# EAGLE design Main (EAGLE 7.2.0)
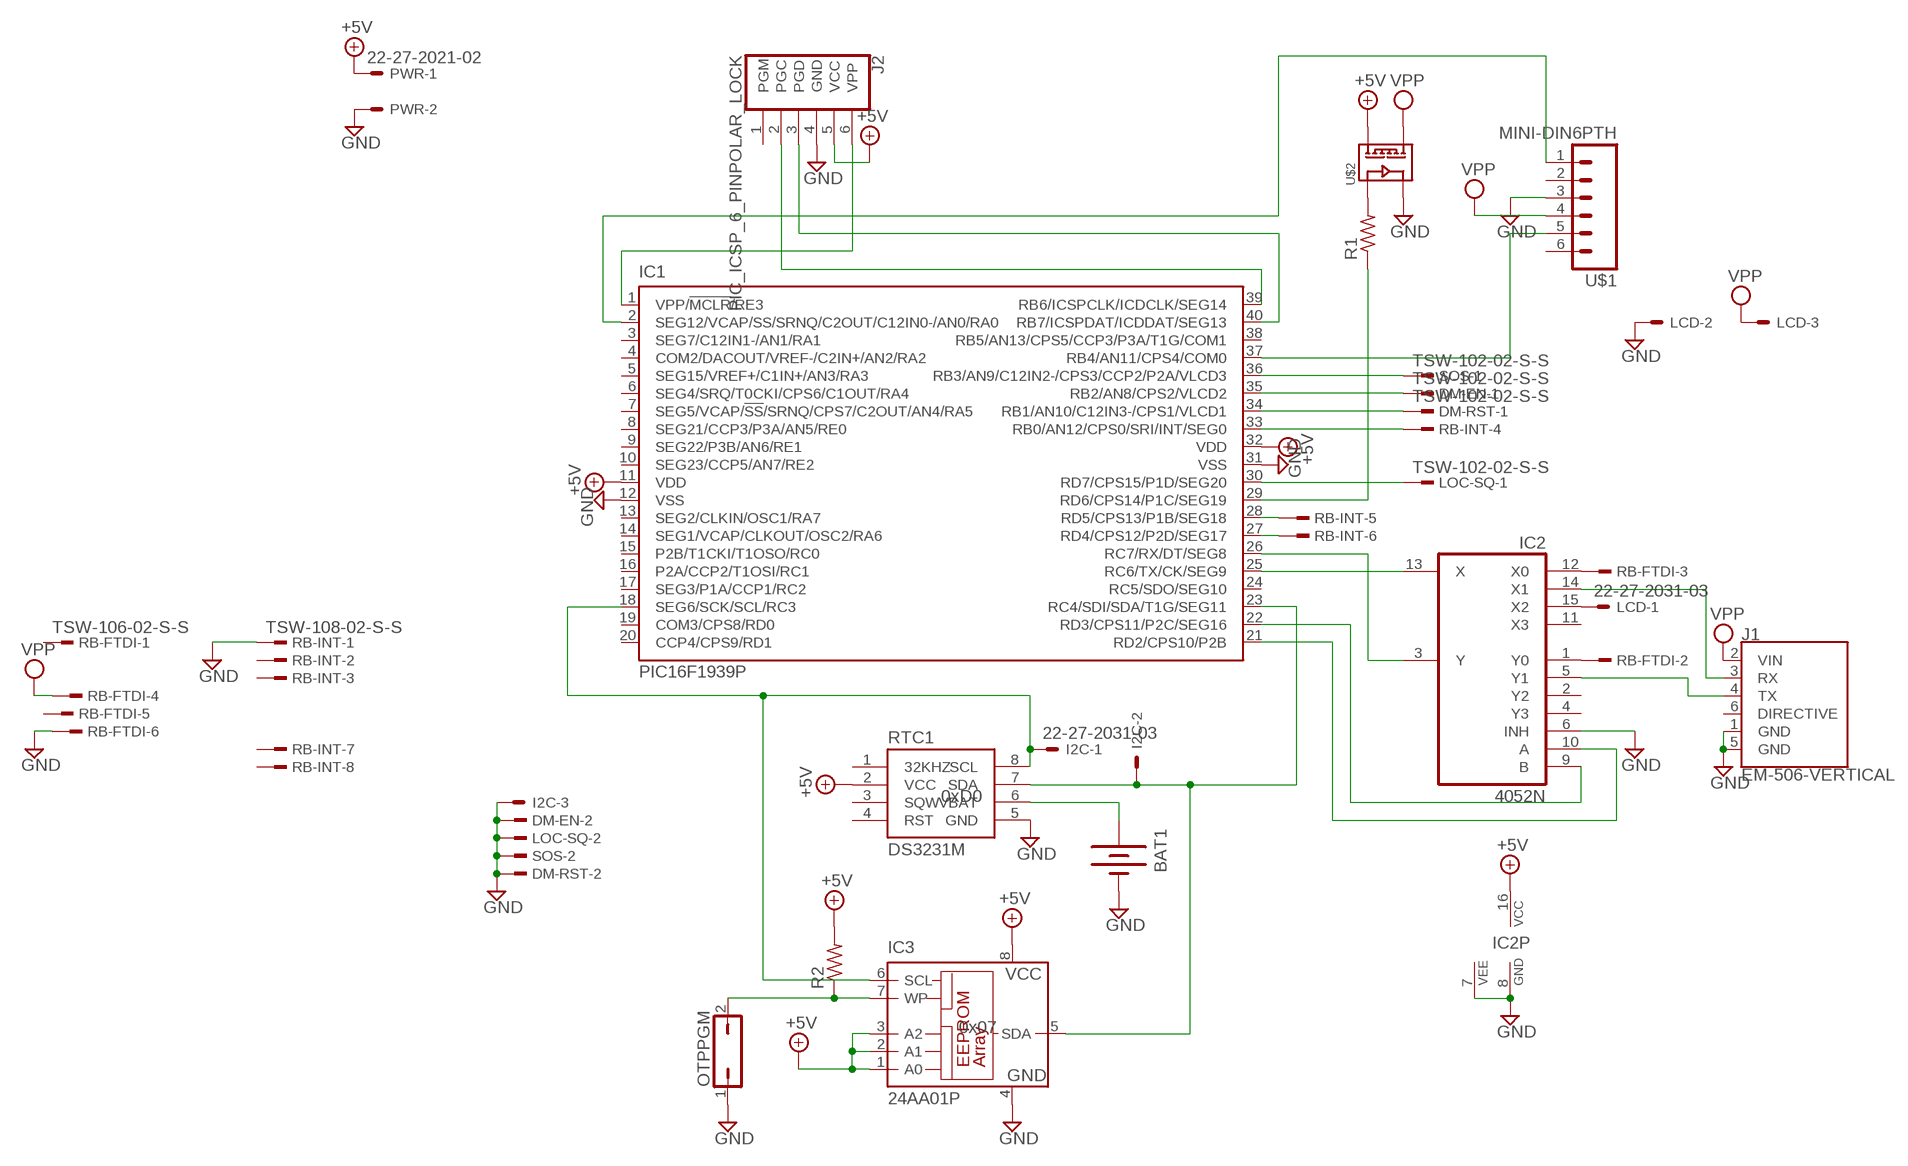
[diagram p0: schematic, sheet 1]

## Parts
BAT1  BATTERY12PTH  [BATTCON_12MM_PTH]
DM-EN  TSW-102-02-S-S  [TSW-102-02-S-S]
DM-RST  TSW-102-02-S-S  [TSW-102-02-S-S]
I2C  22-27-2031-03  [6410-03]
IC1  PIC16F1939P  [DIL40]
IC2  4052N  [DIL16]
IC3  24AA01P  [DIL8]
J1  EM-506-VERTICAL  [EM406]
J2  PIC_ICSP_6_PINPOLAR_LOCK  [MOLEX-1X6_LOCK]
LCD  22-27-2031-03  [6410-03]
LOC-SQ  TSW-102-02-S-S  [TSW-102-02-S-S]
OTPPGM  JP1Q  [JP1]
PWR  22-27-2021-02  [6410-02]
R1  R-US_0204/2V  [0204V]
R2  R-US_0204/2V  [0204V]
RB-FTDI  TSW-106-02-S-S  [TSW-106-02-S-S]
RB-INT  TSW-108-02-S-S  [TSW-108-02-S-S]
RTC1  DS3231M  [SOIC8]
SOS  TSW-102-02-S-S  [TSW-102-02-S-S]
U$1  MINI-DIN6PTH  [MINI-DIN6]
U$2  CPC1008N  [SOP04]

## Nets
+5V: IC1.11(VDD) IC1.32(VDD) IC2.16(VCC) IC3.1(A0) IC3.2(A1) IC3.3(A2) IC3.8(VCC) J2.5(VCC) PWR.1 R2.2 RTC1.2(VCC) U$2.4(DC)
GND: BAT1.GND(-) DM-EN.2 DM-RST.2 I2C.3 IC1.12(VSS) IC1.31(VSS) IC2.6(INH) IC2.7(VEE) IC2.8(GND) IC3.4(GND) J1.1(GND) J1.5(GND) J2.4(GND) LCD.2 LOC-SQ.2 OTPPGM.1 PWR.2 RB-FTDI.6 RB-INT.1 RTC1.5(GND) SOS.2 U$1.3 U$2.3(IN-)
N$1: IC1.26(RC7/RX/DT/SEG8) IC2.3(Y)
N$2: IC1.25(RC6/TX/CK/SEG9) IC2.13(X)
N$3: I2C.1 IC1.18(SEG6/SCK/SCL/RC3) IC3.6(SCL) RTC1.8(SCL)
N$4: I2C.2 IC1.23(RC4/SDI/SDA/T1G/SEG11) IC3.5(SDA) RTC1.7(SDA)
N$5: IC1.30(RD7/CPS15/P1D/SEG20) LOC-SQ.1
N$6: BAT1.VCC@1(+) RTC1.6(VBAT)
N$7: IC2.12(X0) RB-FTDI.3
N$8: IC2.1(Y0) RB-FTDI.2
N$9: IC2.14(X1) J1.3(RX)
N$10: IC2.5(Y1) J1.4(TX)
N$11: IC1.22(RD3/CPS11/P2C/SEG16) IC2.9(B)
N$12: IC2.15(X2) LCD.1
N$13: IC1.21(RD2/CPS10/P2B) IC2.10(A)
N$14: IC1.37(RB4/AN11/CPS4/COM0) U$1.5
N$15: IC1.39(RB6/ICSPCLK/ICDCLK/SEG14) J2.2(PGC)
N$16: IC1.40(RB7/ICSPDAT/ICDDAT/SEG13) J2.3(PGD)
N$17: R1.2 U$2.1(IN+)
N$18: IC1.33(RB0/AN12/CPS0/SRI/INT/SEG0) RB-INT.4
N$19: IC1.28(RD5/CPS13/P1B/SEG18) RB-INT.5
N$20: IC1.27(RD4/CPS12/P2D/SEG17) RB-INT.6
N$21: DM-RST.1 IC1.34(RB1/AN10/C12IN3-/CPS1/VLCD1)
N$22: DM-EN.1 IC1.35(RB2/AN8/CPS2/VLCD2)
N$23: IC1.36(RB3/AN9/C12IN2-/CPS3/CCP2/P2A/VLCD3) SOS.1
N$24: IC1.2(SEG12/VCAP/SS/SRNQ/C2OUT/C12IN0-/AN0/RA0) U$1.1
N$26: IC1.29(RD6/CPS14/P1C/SEG19) R1.1
N$27: IC3.7(WP) OTPPGM.2 R2.1
N$28: IC1.1(VPP/!MCLR!/RE3) J2.6(VPP)
VPP: J1.2(VIN) LCD.3 RB-FTDI.4 U$1.4 U$2.6(DC)
Unconnected: IC1.3(SEG7/C12IN1-/AN1/RA1) IC1.4(COM2/DACOUT/VREF-/C2IN+/AN2/RA2) IC1.5(SEG15/VREF+/C1IN+/AN3/RA3) IC1.6(SEG4/SRQ/T0CKI/CPS6/C1OUT/RA4) IC1.7(SEG5/VCAP/!SS!/SRNQ/CPS7/C2OUT/AN4/RA5) IC1.8(SEG21/CCP3/P3A/AN5/RE0) IC1.9(SEG22/P3B/AN6/RE1) IC1.10(SEG23/CCP5/AN7/RE2) IC1.13(SEG2/CLKIN/OSC1/RA7) IC1.14(SEG1/VCAP/CLKOUT/OSC2/RA6) IC1.15(P2B/T1CKI/T1OSO/RC0) IC1.16(P2A/CCP2/T1OSI/RC1) IC1.17(SEG3/P1A/CCP1/RC2) IC1.19(COM3/CPS8/RD0) IC1.20(CCP4/CPS9/RD1) IC1.24(RC5/SDO/SEG10) IC1.38(RB5/AN13/CPS5/CCP3/P3A/T1G/COM1) IC2.2(Y2) IC2.4(Y3) IC2.11(X3) J1.6(DIRECTIVE) J2.1(PGM) RB-FTDI.1 RB-FTDI.5 RB-INT.2 RB-INT.3 RB-INT.7 RB-INT.8 RTC1.1(32KHZ) RTC1.3(SQW) RTC1.4(RST) U$1.2 U$1.6

## Library data of the parts
BAT1 = SparkFun-Electromechanical:BATTERY: Battery Holders Various common sizes : AA, AAA, 18650 (PRT-12895), 20mm coin cell and 12mm coin cell. 20MM_4LEGS, BATT-10373; PROD_ID: BATT-08315
DM-EN DM-RST LOC-SQ SOS = con-samtec:TSW-102-02-S-S: THROUGH-HOLE .025" SQ POST HEADER Source: Samtec TSW.pdf; OC_FARNELL: unknown; OC_NEWARK: unknown
I2C LCD = con-molex:22-?-03: CONNECTOR wire to board 2.54 mm (.1 inch) pitch header; OC_FARNELL: unknown; OC_NEWARK: unknown
IC1 = microchip:PIC16F193*?: Flash-Based, 8-Bit CMOS Microcontrollers wtih LCD Driver and nanoWatt XLP Technology Auto generated by make-symbol-device-package-bsdl.ulp Rev. 33 Source: http://ww1.microchip.com/downloads/en/DeviceDoc/41364D.pdf; MPN: PIC16F1939-I/P; OC_FARNELL: 1755832; OC_NEWARK: 08R1958
IC2 = 40xx:4052: Dual 4-channel ANALOG MULTIPLEXER
IC3 = microchip:24*: Serial EEPROM I2C; I2CADDR: 0x07; MPN: 24AA01-I/P; OC_FARNELL: 1331266; OC_NEWARK: 35M0692
J1 = SparkFun-RF:EM-506: EM-506 High Performance GPS Module EM-506 GPS module features high sensitivity, low power and ultra small form factor. This GPS module is powered by SiRF Star IV, it can provide you with superior sensitivity and performance even in urban canyon and dense foliage environment. With SiRF CGEE (Client Generated Extended Ephemeris) technology, it predicts satellite positions for up to 3 days and delivers CGEE-start time of less than 15 seconds under most conditions, without any network assistance. Besides, MicroPower Mode allows GPS module to stay in a hot-start condition nearly continuously while consuming very little power. Product Features: SiRF Star IV high performance GPS Chipset Very high sensitivity (Tracking Sensitivity: -163 dBm) Extremely fast TTFF (Time To First Fix) at low signal level Support UART interface. Built-in LNA(with in CHIP) Compact size (30.0mm x 30.0 mm x 10.7mm) suitable for space-sensitive application Support NMEA 0183 V3.0 (GGA, GSA, GSV, RMC, VTG, GLL, ZDA) Support OSP protocol Support SBAS (WASS, EGNOS, MSAS, GAGAN); PROD_ID: CONN-08249
J2 = SparkFun-Connectors:PIC_ICSP_6_PIN: ISCP Programming connector for PICs This 6 pin header contains all the lines necessary for programming most PIC microcontrollers. Here is the connector we sell at SparkFun: Polarized Connectors - Header (6-Pin) <https://www.sparkfun.com/products/8094> (PRT-08094) It is used on this SparkFun product: SparkFun UDB5 - PIC UAV Development Board <https://www.sparkfun.com/products/11703> (DEV-11703) Also, if you need a nice PIC programmer, please check these out: MPLAB PICkit 3 <https://www.sparkfun.com/products/9973> (PGM-09973)
OTPPGM = jumper:JP1Q: JUMPER
PWR = con-molex:22-?-02: CONNECTOR wire to board 2.54 mm (.1 inch) pitch header; OC_FARNELL: unknown; OC_NEWARK: unknown
R1 R2 = resistor:R-US_: RESISTOR, American symbol
RB-FTDI = con-samtec:TSW-106-02-S-S: THROUGH-HOLE .025" SQ POST HEADER Source: Samtec TSW.pdf; OC_FARNELL: unknown; OC_NEWARK: unknown
RB-INT = con-samtec:TSW-108-02-S-S: THROUGH-HOLE .025" SQ POST HEADER Source: Samtec TSW.pdf; OC_FARNELL: unknown; OC_NEWARK: unknown
RTC1 = SparkFun-DigitalIC:DS3231M: DS3231M Real Time Clock. Accuracy +/-5ppm. Battery Backup. 2.3V to 5.5V.; I2CADDR: 0xD0; PROD_ID: IC-11985
U$1 = SparkFun-Connectors:MINI-DIN6: mini DIN 6 Connector Commonly found on the back of a computer for PS2 keyboard and mice. Schematic and footprint are proven. Spark Fun Electronics SKU : PRT-08509
U$2 = JSB2:CPC1008N

## Board
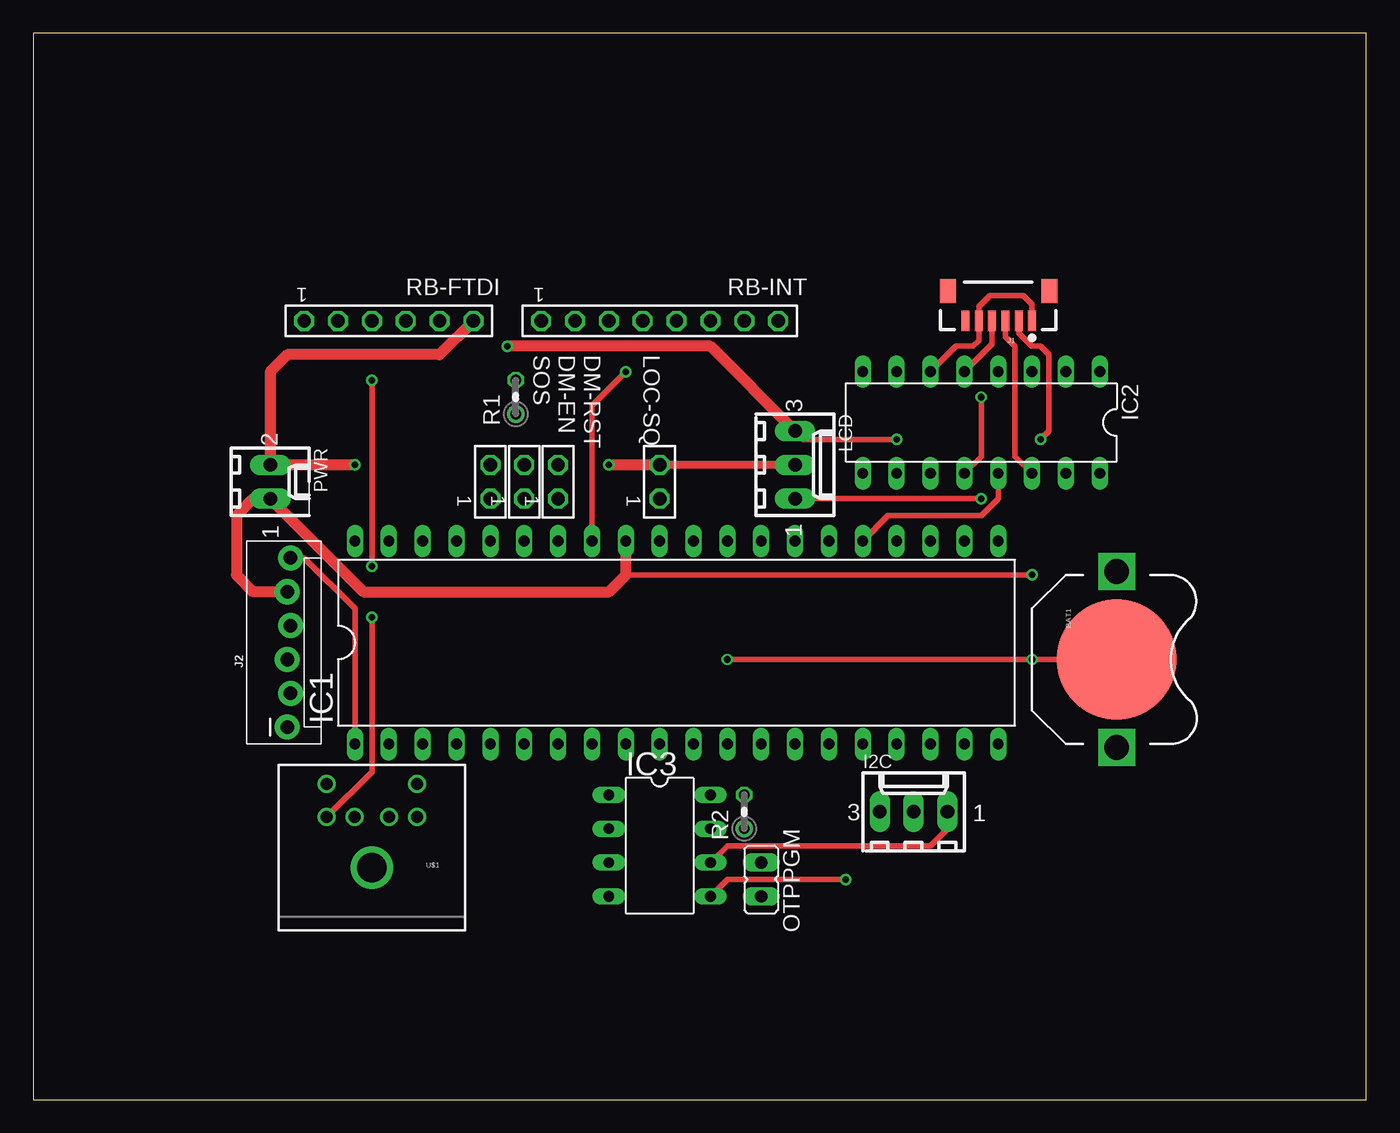
[diagram p1: board, top side]
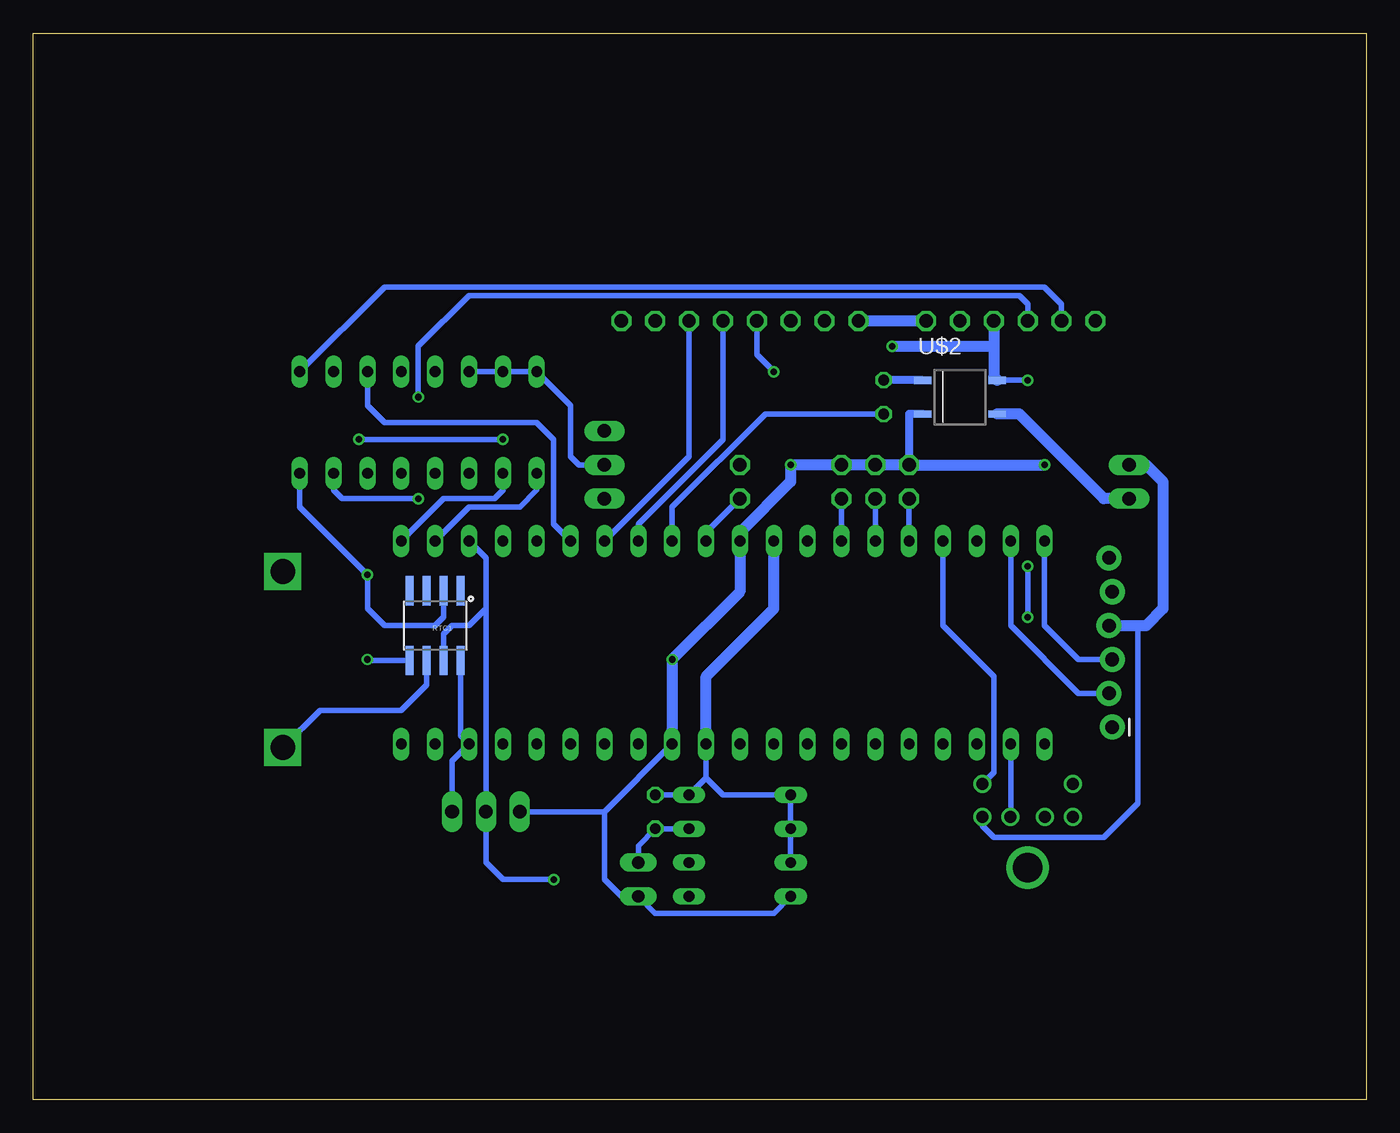
[diagram p2: board, bottom side, seen from below]

Size 100 x 80 mm. Coordinates in mm from the lower left corner, seen from the top.
Outline: 0,0 100,0 100,80 0,80 0,0
Copper layers (1*16): Top 0.0356mm / dielectric 1.5011mm / Bottom 0.0356mm
Design rules "Oshpark": minimum track width 6mil, minimum drill 13mil, track to track 6mil, track to pad 6mil, pad to pad 6mil, via to via 6mil, smd to smd 6mil, copper to edge 15mil, drill to drill 6mil, minimum pad ring 7mil, minimum via ring 7mil, stop-mask expansion 3mil, vias tented up to drill 0mil, thermal gap 10mil

### Footprints (pad centres in the part's own frame; a part is rotated, then mirrored left to right if it is on the bottom)
BATTCON_12MM_PTH = smd 9 x 9: GND 0,0 | drill 1.854 square: VCC@1 6.604,0; VCC@2 -6.604,0
TSW-102-02-S-S = drill 1 pad 1.5 octagon: 1 1.27,0; 2 -1.27,0
6410-03 = drill 1.016 long: 1 2.54,0; 2 0,0; 3 -2.54,0
DIL40 = drill 0.813 long: 1 -24.13,-7.62; 2 -21.59,-7.62; 3 -19.05,-7.62; 4 -16.51,-7.62; 5 -13.97,-7.62; 6 -11.43,-7.62; 7 -8.89,-7.62; 8 -6.35,-7.62; 9 -3.81,-7.62; 10 -1.27,-7.62; 11 1.27,-7.62; 12 3.81,-7.62; 13 6.35,-7.62; 14 8.89,-7.62; 15 11.43,-7.62; 16 13.97,-7.62; 17 16.51,-7.62; 18 19.05,-7.62; 19 21.59,-7.62; 20 24.13,-7.62; 21 24.13,7.62; 22 21.59,7.62; 23 19.05,7.62; 24 16.51,7.62; 25 13.97,7.62; 26 11.43,7.62; 27 8.89,7.62; 28 6.35,7.62; 29 3.81,7.62; 30 1.27,7.62; 31 -1.27,7.62; 32 -3.81,7.62; 33 -6.35,7.62; 34 -8.89,7.62; 35 -11.43,7.62; 36 -13.97,7.62; 37 -16.51,7.62; 38 -19.05,7.62; 39 -21.59,7.62; 40 -24.13,7.62
DIL16 = drill 0.813 long: 1 -8.89,-3.81; 2 -6.35,-3.81; 3 -3.81,-3.81; 4 -1.27,-3.81; 5 1.27,-3.81; 6 3.81,-3.81; 7 6.35,-3.81; 8 8.89,-3.81; 9 8.89,3.81; 10 6.35,3.81; 11 3.81,3.81; 12 1.27,3.81; 13 -1.27,3.81; 14 -3.81,3.81; 15 -6.35,3.81; 16 -8.89,3.81
DIL8 = drill 0.813 long: 1 -3.81,-3.81; 2 -1.27,-3.81; 3 1.27,-3.81; 4 3.81,-3.81; 5 3.81,3.81; 6 1.27,3.81; 7 -1.27,3.81; 8 -3.81,3.81
EM406 = smd 0.6 x 1.55: 1 0,0; 2 1,0; 3 2,0; 4 3,0; 5 4,0; 6 5,0 | smd 1.2 x 1.8: P$1 -1.3,-2.225; P$2 6.3,-2.225
MOLEX-1X6_LOCK = drill 1.016 pad 1.88: 1 0,0; 2 2.54,-0.254; 3 5.08,0; 4 7.62,-0.254; 5 10.16,0; 6 12.7,-0.254
JP1 = drill 0.914 long: 1 0,-1.27; 2 0,1.27
6410-02 = drill 1.016 long: 1 1.27,0; 2 -1.27,0
0204V = drill 0.813 octagon: 1 -1.27,0; 2 1.27,0
TSW-106-02-S-S = drill 1 pad 1.5 octagon: 1 6.35,0; 2 3.81,0; 3 1.27,0; 4 -1.27,0; 5 -3.81,0; 6 -6.35,0
TSW-108-02-S-S = drill 1 pad 1.5 octagon: 1 8.89,0; 2 6.35,0; 3 3.81,0; 4 1.27,0; 5 -1.27,0; 6 -3.81,0; 7 -6.35,0; 8 -8.89,0
SOIC8 = smd 0.61 x 2.21: 1 -1.905,-2.616; 2 -0.635,-2.616; 3 0.635,-2.616; 4 1.905,-2.616; 5 1.905,2.616; 6 0.635,2.616; 7 -0.635,2.616; 8 -1.905,2.616
MINI-DIN6 = drill 0.9: 1 -1.3,-8.5; 2 1.3,-8.5; 3 -3.4,-8.5; 4 3.4,-8.5; 5 -3.4,-11; 6 3.4,-11 | drill 2.2: P$1 0,-4.7
SOP04 = smd 0.551 x 1.3: 1 -1.27,-2.8; 3 1.27,-2.8; 4 1.27,2.8; 6 -1.27,2.8

### Placement (x,y rotation side)
BAT1  81.28,33.02 270 top
DM-EN  36.83,46.35 270 top
DM-RST  39.37,46.35 270 top
I2C  66.04,21.59 0 top
IC1  48.26,34.29 0 top
IC2  71.12,50.8 180 top
IC3  46.99,19.05 270 top
J1  74.93,58.42 180 top
J2  19.05,27.94 90 top
LCD  57.15,47.62 270 top
LOC-SQ  46.99,46.35 270 top
OTPPGM  54.61,16.51 0 top
PWR  17.78,46.35 270 top
R1  36.2,52.7 90 top
R2  53.34,21.59 90 top
RB-FTDI  26.67,58.42 180 top
RB-INT  46.99,58.42 180 top
RTC1  69.85,35.56 180 bottom
SOS  34.29,46.35 270 top
U$1  25.4,12.7 180 top
U$2  30.48,52.7 270 bottom

### Tracks (layer width: path | path; a pad name or v marks a point on that pad's centre or on a via)
+5V  (via drill 0.5)
  Top 0.406: 44.45,39.37 v74.93,39.37
  Top 0.813: IC1.32 44.45,39.37 43.18,38.1 24.77,38.1 PWR.1 16.51,45.09 15.24,43.81 15.24,39.37 16.51,38.1 J2.5
  Bottom 0.406: RTC1.2 69.22,36.2 69.85,35.56 73.66,35.56 74.93,36.83 v74.93,39.37 80.01,44.45 IC2.16 | IC3.3 IC3.2 IC3.1 48.26,22.86 49.53,24.13 | IC1.11 49.53,24.13 | 49.53,24.13 IC3.8 R2.2
  Bottom 0.813: PWR.1 19.68,45.09 26.04,51.44 U$2.4 | IC1.11 49.53,31.75 44.45,36.83 IC1.32
GND  (via drill 0.5)
  Top 0.406: BAT1.GND v74.93,33.02 v52.07,33.02 | IC2.6 69.22,56.52 70.48,56.52 70.93,56.96 J1.5 70.93,59.5 71.75,60.33 74.3,60.33 74.93,59.69 J1.1
  Top 0.61: LCD.2 LOC-SQ.2
  Top 0.813: v24.13,47.62 PWR.2 17.78,54.61 19.05,55.88 30.48,55.88 RB-FTDI.6 | LOC-SQ.2 v43.18,47.62
  Bottom 0.406: RTC1.5 74.85,32.94 v74.93,33.02 | IC2.6 IC2.7 IC2.8 59.69,52.07 59.69,48.26 59.05,47.62 LCD.2 | U$1.3 28.8,20.55 27.94,19.68 19.68,19.68 17.14,22.23 17.14,35.56 | IC1.12 57.15,21.59 | 57.15,21.59 I2C.3 | 57.15,21.59 57.15,16.51 55.88,15.24 OTPPGM.1 53.34,13.97 44.45,13.97 IC3.4
  Bottom 0.61: U$2.3 34.29,51.44 SOS.2
  Bottom 0.813: PWR.2 16.51,47.62 15.24,46.35 15.24,36.83 16.51,35.56 17.14,35.56 J2.4 | IC1.12 v52.07,33.02 46.99,38.1 IC1.31 46.99,42.55 43.18,46.35 v43.18,47.62 DM-RST.2 DM-EN.2 SOS.2 v24.13,47.62 | RB-FTDI.6 RB-INT.1
N$1
  Bottom 0.406: IC1.26 60.96,43.18 60.96,49.53 62.23,50.8 73.66,50.8 74.93,52.07 IC2.3
N$2
  Top 0.406: IC1.25 64.14,43.81 71.12,43.81 72.39,45.09 IC2.13
N$3
  Top 0.406: IC3.6 52.07,19.05 67.31,19.05 68.58,20.32 I2C.1
  Bottom 0.406: RTC1.8 67.94,27.3 IC1.18 68.58,25.4 I2C.1
N$4  (via drill 0.5)
  Top 0.406: IC3.5 52.07,16.51 v60.96,16.51
  Bottom 0.406: RTC1.7 69.22,34.92 68.58,35.56 67.31,35.56 66.04,36.83 | 66.04,36.83 66.04,40.64 IC1.23 | 66.04,36.83 I2C.2 66.04,17.78 64.77,16.51 v60.96,16.51
N$5
  Bottom 0.406: IC1.30 49.53,42.55 LOC-SQ.1
N$6
  Bottom 0.406: RTC1.6 70.48,31.11 72.39,29.21 78.49,29.21 BAT1.VCC@1
N$7  (via drill 0.5)
  Top 0.406: v71.12,52.7 71.12,48.26 IC2.12
  Bottom 0.406: RB-FTDI.3 25.4,59.69 26.04,60.33 67.31,60.33 71.12,56.52 v71.12,52.7
N$8
  Bottom 0.406: RB-FTDI.2 22.86,59.69 24.13,60.96 73.66,60.96 IC2.1
N$9
  Top 0.406: J1.3 72.93,57.24 73.66,56.52 73.66,48.26 IC2.14
N$10
  Top 0.406: J1.4 71.93,56.69 IC2.5
N$11
  Bottom 0.406: IC2.9 62.23,45.72 63.5,44.45 67.31,44.45 IC1.22
N$12  (via drill 0.5)
  Top 0.406: v71.12,45.09 LCD.1
  Bottom 0.406: IC2.15 77.47,45.72 76.83,45.09 v71.12,45.09
N$13
  Bottom 0.406: IC2.10 64.77,45.72 65.41,45.09 69.22,45.09 IC1.21
N$14
  Bottom 0.406: IC1.37 31.75,35.56 27.94,31.75 27.94,24.56 U$1.5
N$15
  Bottom 0.406: IC1.39 26.67,35.56 21.59,30.48 J2.2
N$16
  Bottom 0.406: IC1.40 24.13,35.56 21.59,33.02 J2.3
N$17
  Bottom 0.61: U$2.1 R1.2
N$18  (via drill 0.5)
  Top 0.406: v44.45,54.61 41.91,52.07 IC1.33
  Bottom 0.406: RB-INT.4 45.72,55.88 v44.45,54.61
N$19
  Bottom 0.406: RB-INT.5 48.26,49.53 54.61,43.18 IC1.28
N$20
  Bottom 0.406: RB-INT.6 50.8,48.26 IC1.27
N$21
  Bottom 0.406: DM-RST.1 IC1.34
N$22
  Bottom 0.406: DM-EN.1 IC1.35
N$23
  Bottom 0.406: SOS.1 IC1.36
N$24
  Bottom 0.406: IC1.2 26.67,21.23 U$1.1
N$26
  Bottom 0.406: IC1.29 52.07,44.45 45.09,51.44 R1.1
N$27
  Bottom 0.406: OTPPGM.2 54.61,19.05 R2.1 IC3.7
N$28
  Top 0.406: J2.6 20.32,40.64 24.13,36.83 IC1.1
VPP  (via drill 0.5)
  Top 0.406: J1.2 73.93,57.52 74.93,56.52 75.56,56.52 76.2,55.88 76.2,50.16 v75.56,49.53 | v64.77,49.53 57.78,49.53 LCD.3 | v25.4,53.98 v25.4,40.01 | v25.4,36.2 25.4,24.6 U$1.4
  Top 0.813: LCD.3 50.8,56.52 v35.56,56.52
  Bottom 0.406: v75.56,49.53 v64.77,49.53 | U$2.6 v25.4,53.98 | v25.4,40.01 v25.4,36.2
  Bottom 0.813: RB-FTDI.4 27.94,56.52 | 27.94,56.52 27.94,54.23 U$2.6 | v35.56,56.52 27.94,56.52